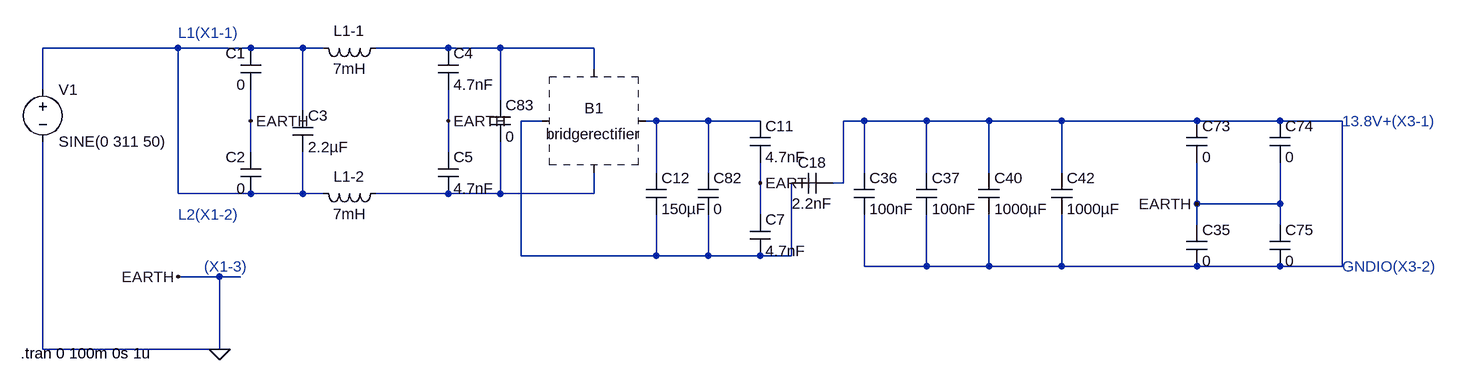
[diagram p0: schematic Leakeage-Model.asc]
Leakeage-Model.asc, the LTspice schematic file:
Version 4
SHEET 1 1892 680
WIRE -64 -128 -272 -128
WIRE 48 -128 -64 -128
WIRE 128 -128 48 -128
WIRE 160 -128 128 -128
WIRE 352 -128 240 -128
WIRE 432 -128 352 -128
WIRE 576 -128 432 -128
WIRE 576 -96 576 -128
WIRE -272 -64 -272 -128
WIRE 432 -48 432 -128
WIRE 128 -32 128 -128
WIRE 48 -16 48 -64
WIRE 352 -16 352 -64
WIRE 496 -16 464 -16
WIRE 672 -16 656 -16
WIRE 752 -16 672 -16
WIRE 832 -16 752 -16
WIRE 992 -16 960 -16
WIRE 1088 -16 992 -16
WIRE 1184 -16 1088 -16
WIRE 1296 -16 1184 -16
WIRE 1504 -16 1296 -16
WIRE 1632 -16 1504 -16
WIRE 1728 -16 1632 -16
WIRE 48 32 48 -16
WIRE 352 32 352 -16
WIRE 672 64 672 -16
WIRE 752 64 752 -16
WIRE 992 64 992 -16
WIRE 1088 64 1088 -16
WIRE 1184 64 1184 -16
WIRE 1296 64 1296 -16
WIRE 832 80 832 48
WIRE 960 80 960 -16
WIRE 960 80 944 80
WIRE -64 96 -64 -128
WIRE 48 96 -64 96
WIRE 128 96 128 32
WIRE 128 96 48 96
WIRE 160 96 128 96
WIRE 352 96 240 96
WIRE 432 96 432 16
WIRE 432 96 352 96
WIRE 576 96 576 64
WIRE 576 96 432 96
WIRE 1504 112 1504 48
WIRE 1632 112 1632 48
WIRE 1632 112 1504 112
WIRE 832 128 832 80
WIRE 1504 144 1504 112
WIRE 1632 144 1632 112
WIRE 464 192 464 -16
WIRE 672 192 672 128
WIRE 672 192 464 192
WIRE 752 192 752 128
WIRE 752 192 672 192
WIRE 832 192 752 192
WIRE 880 192 880 80
WIRE 880 192 832 192
WIRE 992 208 992 128
WIRE 1088 208 1088 128
WIRE 1088 208 992 208
WIRE 1184 208 1184 128
WIRE 1184 208 1088 208
WIRE 1296 208 1296 128
WIRE 1296 208 1184 208
WIRE 1504 208 1296 208
WIRE 1632 208 1504 208
WIRE 1728 208 1728 -16
WIRE 1728 208 1632 208
WIRE 0 224 -64 224
WIRE 32 224 0 224
WIRE -272 336 -272 16
WIRE 0 336 0 224
WIRE 0 336 -272 336
FLAG 48 -16 EARTH
FLAG 352 -16 EARTH
FLAG 832 80 EARTH
FLAG 1504 112 EARTH
FLAG -64 224 EARTH
FLAG 0 336 0
SYMBOL cap 112 -32 R0
SYMATTR InstName C3
SYMATTR Value 2.2µF
SYMBOL cap 64 -64 R180
WINDOW 0 24 56 Left 2
WINDOW 3 24 8 Left 2
SYMATTR InstName C1
SYMATTR Value 0
SYMBOL cap 64 96 R180
WINDOW 0 24 56 Left 2
WINDOW 3 24 8 Left 2
SYMATTR InstName C2
SYMATTR Value 0
SYMBOL cap 416 -48 R0
SYMATTR InstName C83
SYMATTR Value 0
SYMBOL cap 336 -128 R0
SYMATTR InstName C4
SYMATTR Value 4.7nF
SYMBOL cap 336 32 R0
SYMATTR InstName C5
SYMATTR Value 4.7nF
SYMBOL cap 736 64 R0
SYMATTR InstName C82
SYMATTR Value 0
SYMBOL cap 816 -16 R0
SYMATTR InstName C11
SYMATTR Value 4.7nF
SYMBOL cap 816 128 R0
SYMATTR InstName C7
SYMATTR Value 4.7nF
SYMBOL cap 656 64 R0
SYMATTR InstName C12
SYMATTR Value 150µF
SYMBOL cap 1072 64 R0
SYMATTR InstName C37
SYMATTR Value 100nF
SYMBOL ind 256 -144 R90
WINDOW 0 5 56 VBottom 2
WINDOW 3 32 56 VTop 2
SYMATTR InstName L1-1
SYMATTR Value 7mH
SYMBOL ind 256 80 R90
WINDOW 0 5 56 VBottom 2
WINDOW 3 32 56 VTop 2
SYMATTR InstName L1-2
SYMATTR Value 7mH
SYMBOL ZZZ\\bridgerectifier\\bridgerectifier 576 -16 R0
SYMATTR InstName B1
SYMBOL cap 944 64 R90
WINDOW 0 0 32 VBottom 2
WINDOW 3 32 32 VTop 2
SYMATTR InstName C18
SYMATTR Value 2.2nF
SYMBOL cap 976 64 R0
SYMATTR InstName C36
SYMATTR Value 100nF
SYMBOL cap 1168 64 R0
SYMATTR InstName C40
SYMATTR Value 1000µF
SYMBOL cap 1280 64 R0
SYMATTR InstName C42
SYMATTR Value 1000µF
SYMBOL cap 1488 -16 R0
SYMATTR InstName C73
SYMATTR Value 0
SYMBOL cap 1616 -16 R0
SYMATTR InstName C74
SYMATTR Value 0
SYMBOL cap 1488 144 R0
SYMATTR InstName C35
SYMATTR Value 0
SYMBOL cap 1616 144 R0
SYMATTR InstName C75
SYMATTR Value 0
SYMBOL voltage -272 -80 R0
WINDOW 123 0 0 Left 0
WINDOW 39 0 0 Left 0
SYMATTR InstName V1
SYMATTR Value SINE(0 311 50)
TEXT -64 -152 Left 2 ;L1(X1-1)
TEXT -64 128 Left 2 ;L2(X1-2)
TEXT -24 208 Left 2 ;(X1-3)
TEXT 1728 -16 Left 2 ;13.8V+(X3-1)
TEXT 1728 208 Left 2 ;GNDIO(X3-2)
TEXT -306 342 Left 2 !.tran 0 100m 0s 1u

The netlist it stands for:
* Leakeage-Model.asc
C3 N001 N001 2.2µF
C1 0 N001 0
C2 N001 0 0
C83 N002 N006 0
C4 N002 0 4.7nF
C5 0 N006 4.7nF
C82 N004 N003 0
C11 N004 0 4.7nF
C7 0 N003 4.7nF
C12 N004 N003 150µF
C37 N005 N005 100nF
L1-1 N002 N001 7mH
L1-2 N006 N001 7mH
* B1: bridgerectifier (symbol ZZZ\bridgerectifier\bridgerectifier not available, pin order unknown); nets seen at it: N002, N003, N004, N006
C18 N005 N003 2.2nF
C36 N005 N005 100nF
C40 N005 N005 1000µF
C42 N005 N005 1000µF
C73 N005 0 0
C74 N005 0 0
C35 0 N005 0
C75 0 N005 0
V1 N001 0 SINE(0 311 50)
* L1(X1-1)
* L2(X1-2)
* (X1-3)
* 13.8V+(X3-1)
* GNDIO(X3-2)
.tran 0 100m 0s 1u
.backanno
.end